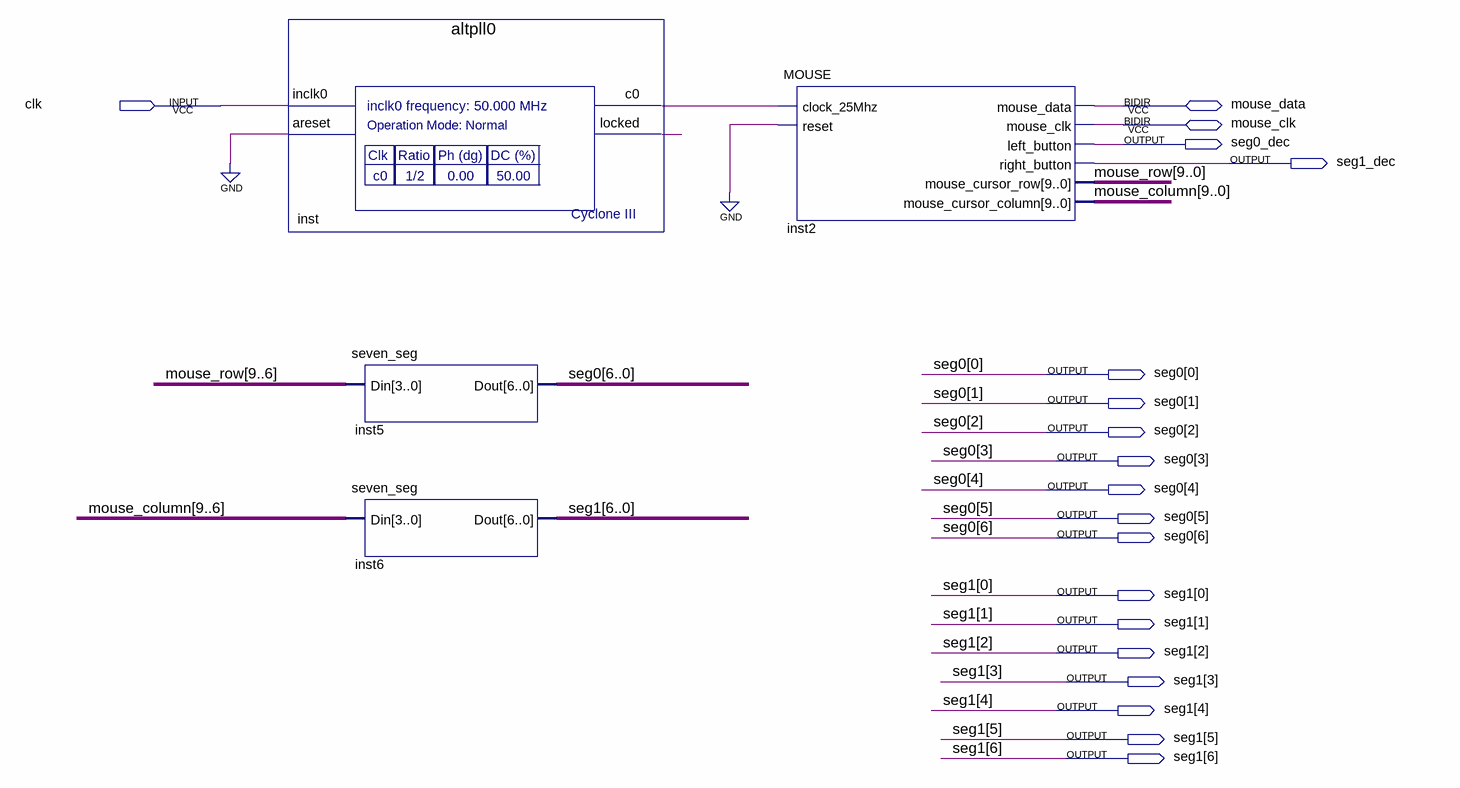
[diagram p0: schematic sheet]
// Quartus schematic mouse interface.bdf as structural Verilog: 4 symbols, 19 pins
module \mouse_interface  (
  input  clk,
  inout  mouse_data,
  inout  mouse_clk,
  output seg0_dec,
  output seg1_dec,
  output [6:0] seg0,
  output [6:0] seg1
);

  wire inst_c0, inst_locked;
  wire [9:0] mouse_column, mouse_row;

  altpll0 inst (.inclk0(clk), .areset(1'b0), .c0(inst_c0), .locked(inst_locked));
  seven_seg inst5 (.Din(mouse_row[9:6]), .Dout(seg0));
  seven_seg inst6 (.Din(mouse_column[9:6]), .Dout(seg1));
  MOUSE inst2 (
    .clock_25Mhz(inst_c0), .reset(1'b0), .left_button(seg0_dec), .right_button(seg1_dec),
    .mouse_cursor_row(mouse_row), .mouse_cursor_column(mouse_column), .mouse_data(mouse_data),
    .mouse_clk(mouse_clk));
endmodule
